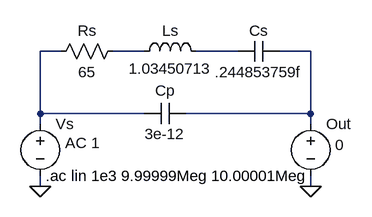
[diagram p0: schematic 01_CrystalModel_10MHz_0Z load.asc]
01_CrystalModel_10MHz_0Z load.asc, the LTspice schematic file:
Version 4
SHEET 1 880 680
WIRE 32 176 0 176
WIRE 160 176 112 176
WIRE 304 176 240 176
WIRE 416 176 368 176
WIRE 0 272 0 176
WIRE 160 272 0 272
WIRE 416 272 416 176
WIRE 416 272 224 272
WIRE 0 288 0 272
WIRE 416 288 416 272
WIRE 0 384 0 368
WIRE 416 384 416 368
FLAG 0 384 0
FLAG 416 384 0
SYMBOL cap 160 288 R270
WINDOW 0 36 32 VTop 0
WINDOW 3 0 32 VBottom 0
SYMATTR InstName Cp
SYMATTR Value 3e-12
SYMBOL cap 304 192 R270
WINDOW 0 32 32 VTop 0
WINDOW 3 0 32 VBottom 0
SYMATTR InstName Cs
SYMATTR Value .244853759f
SYMBOL ind 144 192 R270
WINDOW 0 32 56 VTop 0
WINDOW 3 5 56 VBottom 0
SYMATTR InstName Ls
SYMATTR Value 1.03450713
SYMBOL res 16 192 R270
WINDOW 0 32 56 VTop 0
WINDOW 3 0 56 VBottom 0
SYMATTR InstName Rs
SYMATTR Value 65
SYMBOL voltage 0 272 R0
WINDOW 123 38 45 Left 0
WINDOW 39 0 0 Left 0
SYMATTR Value2 AC 1
SYMATTR InstName Vs
SYMATTR Value ""
SYMBOL voltage 416 272 R0
WINDOW 123 0 0 Left 0
WINDOW 39 0 0 Left 0
WINDOW 3 38 48 Left 0
SYMATTR Value 0
SYMATTR InstName Out
TEXT 8 368 Left 0 !.ac lin 1e3 9.99999Meg 10.00001Meg

The netlist it stands for:
* 01_CrystalModel_10MHz_0Z load.asc
Cp N001 N004 3e-12
Cs N003 N004 .244853759f
Ls N002 N003 1.03450713
Rs N001 N002 65
Vs N001 0 AC 1
V§Out N004 0 0
.ac lin 1e3 9.99999Meg 10.00001Meg
.backanno
.end